# EAGLE design LPC_4TE_3.43_25controller_extv (EAGLE 5.04)
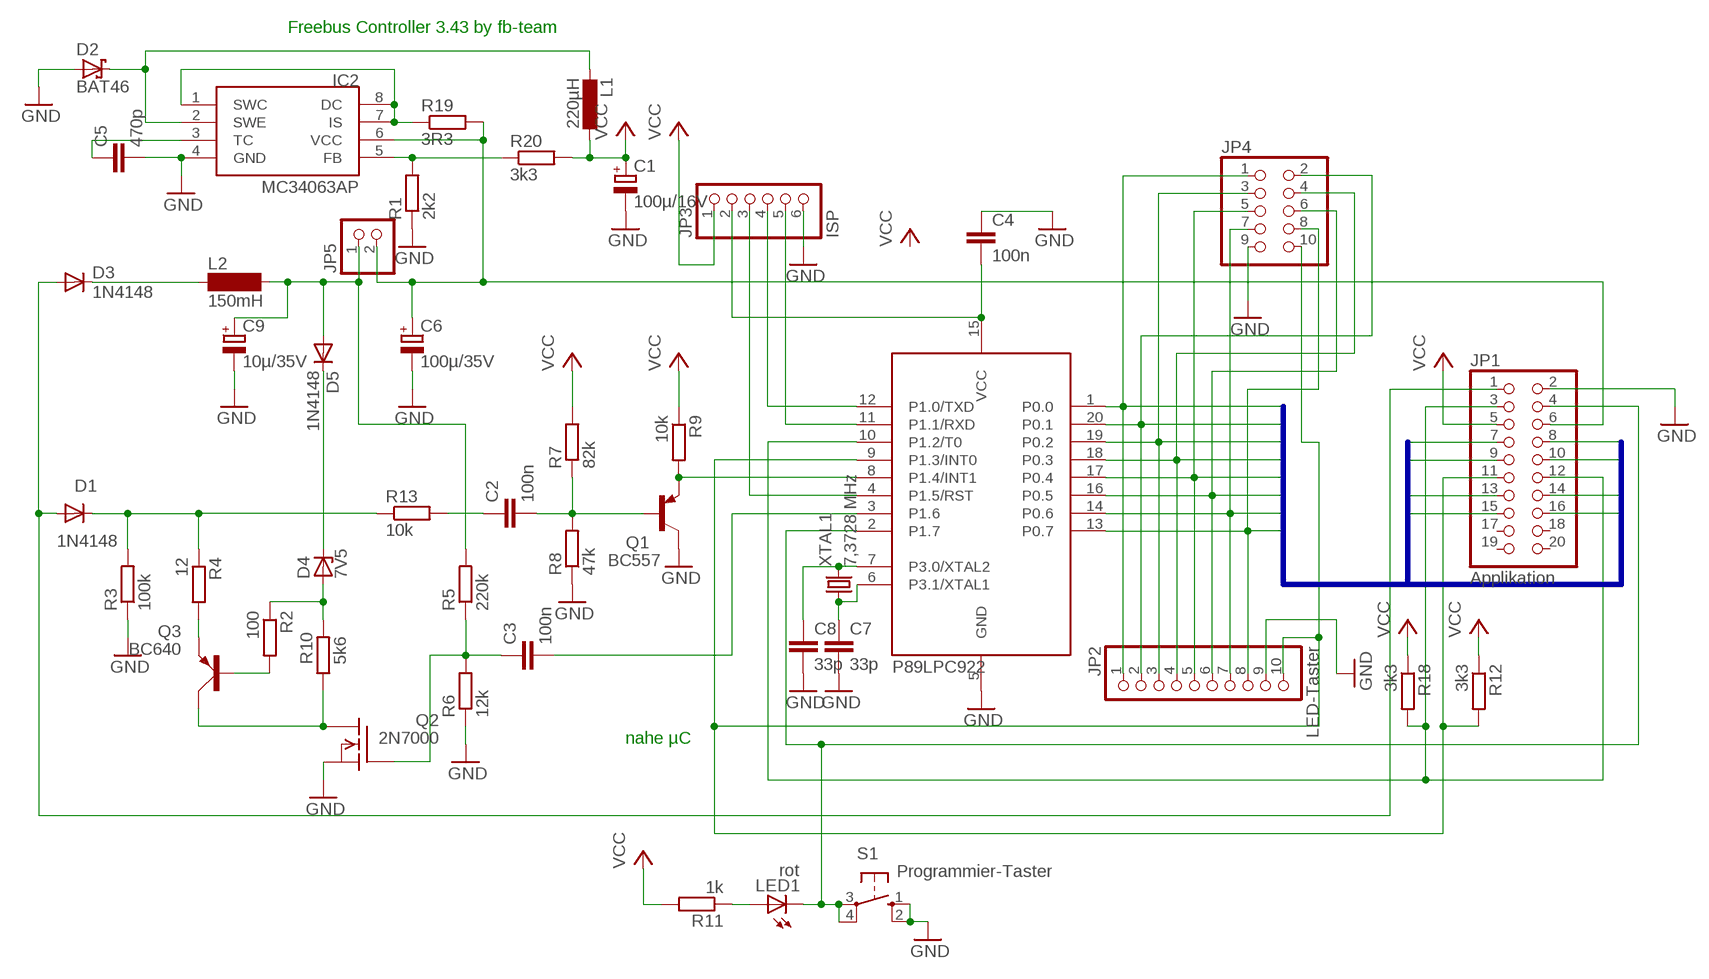
[diagram p0: schematic, sheet 1]

## Parts
C1  100µ/16V  CPOL-EUE5-8.5  [E5-8,5]
C2  100n  C-EU050-024X044  [C050-024X044]
C3  100n  C-EU050-024X044  [C050-024X044]
C4  100n  C-EU050-024X044  [C050-024X044]
C5  470p  C-EU025-024X044  [C025-024X044]
C6  100µ/35V  CPOL-EUE5-8.5  [E5-8,5]
C7  33p  C-EU025-024X044  [C025-024X044]
C8  33p  C-EU025-024X044  [C025-024X044]
C9  10µ/35V  CPOL-EUE5-8.5  [E5-8,5]
D1  1N4148  [DO35-10]
D2  BAT46  BAT49  [DO41-10]
D3  1N4148  [DO35-10]
D4  7V5  ZPD  [DO35Z10]
D5  1N4148  [DO35-10]
IC1  89LPC922  [DIL20]
IC2  MC34063AP  [DIL08]
JP1  Applikation  PINHD-2X10  [2X10]
JP2  LED-Taster  PINHD-1X10  [1X10]
JP3  ISP  PINHD-1X6  [1X06]
JP4  PINHD-2X5  [2X05]
JP5  PINHD-1X2  [1X02]
L1  220µH  L-EU2200-12.7  [2200-12.7]
L2  150mH  SD12-1000  [SD12_1000]
LED1  rot  LED3MM  [LED3MM]
Q1  BC557  [TO92]
Q2  2N7000  VN2222KM  [TO237]
Q3  BC640  [SOT54D]
R1  2k2  R-EU_0207/10  [0207/10]
R2  100  R-EU_0207/10  [0207/10]
R3  100k  R-EU_0207/10  [0207/10]
R4  12  R-EU_0207/10  [0207/10]
R5  220k  R-EU_0207/10  [0207/10]
R6  12k  R-EU_0207/10  [0207/10]
R7  82k  R-EU_0207/10  [0207/10]
R8  47k  R-EU_0207/10  [0207/10]
R9  10k  R-EU_0207/10  [0207/10]
R10  5k6  R-EU_0207/10  [0207/10]
R11  1k  R-EU_0207/10  [0207/10]
R12  3k3  R-EU_0207/10  [0207/10]
R13  10k  R-EU_0207/10  [0207/10]
R18  3k3  R-EU_0207/10  [0207/10]
R19  3R3  R-EU_0207/10  [0207/10]
R20  3k3  R-EU_0207/10  [0207/10]
S1  Programmier-Taster  10-XX  [B3F-10XX]
XTAL1  7,3728 MHz  CRYSTALHC49S  [HC49/S]

## Nets
GND: C1.- C4.1 C5.2 C6.- C7.2 C8.2 C9.- D2.A IC1.5(GND) IC2.4(GND) JP1.2 JP2.9 JP3.6 JP4.9 Q1.3(C) Q2.3(S) R1.1 R3.1 R6.1 R8.1 S1.1(S) S1.2(S1)
N$1: IC1.8(P1.4/INT1) Q1.1(E) R9.2
N$2: C2.2 Q1.2(B) R7.1 R8.2
N$3: IC2.5(FB) R1.2 R20.1
N$4: IC2.1(SWC) IC2.7(IS) IC2.8(DC) R19.1
N$5: C3.2 IC1.3(P1.6)
N$6: Q2.1(D) Q3.C R10.1
N$7: C6.+ IC2.6(VCC) JP1.6 JP5.2 R19.2
N$8: D3.C L2.1
N$9: D1.C R3.2 R4.1 R13.1
N$10: D2.C IC2.2(SWE) L1.2
N$11: D4.A R2.1 R10.2
N$12: Q3.E R4.2
N$13: C5.1 IC2.3(TC)
N$14: Q3.B R2.2
N$15: IC1.9(P1.3/INT0) JP1.11 JP2.10 JP4.10 R12.2
N$16: D1.A D3.A JP1.1
N$17: IC1.2(P1.7) JP1.4 LED1.K(C) S1.3(P) S1.4(P1)
N$18: C2.1 R13.2
N$20: C8.1 IC1.7(P3.0/XTAL2) XTAL1.2
N$21: C7.1 IC1.6(P3.1/XTAL1) XTAL1.1
N$23: C9.+ D5.A JP5.1 L2.2 R5.2
N$29: IC1.12(P1.0/TXD) JP3.4
N$30: IC1.11(P1.1/RXD) JP3.5
N$31: IC1.4(P1.5/RST) JP3.3
N$32: C4.2 IC1.15(VCC) JP3.2
N$33: IC1.10(P1.2/T0) JP1.3 JP1.12 R18.2
N$34: C3.1 Q2.2(G) R5.1 R6.2
N$40: D4.C D5.C
N$41: LED1.A R11.1
P0.0: IC1.1(P0.0) JP1.7 JP2.1 JP4.1
P0.1: IC1.20(P0.1) JP1.8 JP2.2 JP4.2
P0.2: IC1.19(P0.2) JP1.9 JP2.3 JP4.3
P0.3: IC1.18(P0.3) JP1.10 JP2.4 JP4.4
P0.4: IC1.17(P0.4) JP1.13 JP2.5 JP4.5
P0.5: IC1.16(P0.5) JP1.14 JP2.6 JP4.6
P0.6: IC1.14(P0.6) JP1.15 JP2.7 JP4.7
P0.7: IC1.13(P0.7) JP1.16 JP2.8 JP4.8
VCC: C1.+ JP1.5 JP3.1 L1.1 R7.2 R9.1 R11.2 R12.1 R18.1 R20.2
Unconnected: JP1.17 JP1.18 JP1.19 JP1.20

## Buses
P0.[0..7]

## Notes on the sheet
- Freebus Controller 3.43 by fb-team
- P89LPC922
- nahe µC

## Library data of the parts
C1 C6 C9 = rcl:CPOL-EU: POLARIZED CAPACITOR, European symbol
C2-C5 C7 C8 = rcl:C-EU: CAPACITOR, European symbol
D1 D3 D5 = diode:1N4148: DIODE high speed (Philips)
D2 = diode:BAT49: DIODE small signal diode
D4 = diode:ZPD: Z DIODE 500 mW
IC1 = micro-philips:89LPC922
IC2 = mc34063:MC34063
JP1 = pinhead:PINHD-2X10: PIN HEADER
JP2 = pinhead:PINHD-1X10: PIN HEADER
JP3 = pinhead:PINHD-1X6: PIN HEADER
JP4 = pinhead:PINHD-2X5: PIN HEADER
JP5 = pinhead:PINHD-1X2: PIN HEADER
L1 = rcl:L-EU: INDUCTOR, European symbol
L2 = inductor-neosid:SD12: INDUCTOR nominal inductance
LED1 = led:LED: LED OSRAM: - CHIPLED LG R971, LG N971, LY N971, LG Q971, LY Q971, LO R971, LY R971 LH N974, LH R974 LS Q976, LO Q976, LY Q976 LO Q996 - Hyper CHIPLED LW Q18S LB Q993, LB Q99A, LB R99A - SideLED LS A670, LO A670, LY A670, LG A670, LP A670 LB A673, LV A673, LT A673, LW A673 LH A674 LY A675 LS A676, LA A676, LO A676, LY A676, LW A676 LS A679, LY A679, LG A679 - Hyper Micro SIDELED® LS Y876, LA Y876, LO Y876, LY Y876 LT Y87S - SmartLED LW L88C, LW L88S LB L89C, LB L89S, LG L890 LS L89K, LO L89K, LY L89K LS L896, LA L896, LO L896, LY L896 - TOPLED LS T670, LO T670, LY T670, LG T670, LP T670 LSG T670, LSP T670, LSY T670, LOP T670, LYG T670 LG T671, LOG T671, LSG T671 LB T673, LV T673, LT T673, LW T673 LH T674 LS T676, LA T676, LO T676, LY T676, LB T676, LH T676, LSB T676, LW T676 LB T67C, LV T67C, LT T67C, LS T67K, LO T67K, LY T67K, LW E67C LS E67B, LA E67B, LO E67B, LY E67B, LB E67C, LV E67C, LT E67C LW T67C LS T679, LY T679, LG T679 LS T770, LO T770, LY T770, LG T770, LP T770 LB T773, LV T773, LT T773, LW T773 LH T774 LS E675, LA E675, LY E675, LS T675 LS T776, LA T776, LO T776, LY T776, LB T776 LHGB T686 LT T68C, LB T68C - Hyper Mini TOPLED® LB M676 - Mini TOPLED Santana® LG M470 LS M47K, LO M47K, LY M47K Source: http://www.osram.convergy.de - LUMILED® LXK2-PW12-R00, LXK2-PW12-S00, LXK2-PW14-U00, LXK2-PW14-V00 LXK2-PM12-R00, LXK2-PM12-S00, LXK2-PM14-U00 LXK2-PE12-Q00, LXK2-PE12-R00, LXK2-PE12-S00, LXK2-PE14-T00, LXK2-PE14-U00 LXK2-PB12-K00, LXK2-PB12-L00, LXK2-PB12-M00, LXK2-PB14-N00, LXK2-PB14-P00, LXK2-PB14-Q00 LXK2-PR12-L00, LXK2-PR12-M00, LXK2-PR14-Q00, LXK2-PR14-R00 LXK2-PD12-Q00, LXK2-PD12-R00, LXK2-PD12-S00 LXK2-PH12-R00, LXK2-PH12-S00 LXK2-PL12-P00, LXK2-PL12-Q00, LXK2-PL12-R00 Source: www.luxeon.com
Q1 = transistor-pnp:BC557: PNP Transistor
Q2 = transistor-fet:VN2222KM: N-Channel Enhancement MOSFET (VMOS); 60V; 0,5A; 7,5Ohm
Q3 = transistor-small-signal:BC640: PNP TRANSISTOR
R1-R13 R18-R20 = rcl:R-EU_: RESISTOR, European symbol
S1 = switch-omron:10-XX: OMRON SWITCH
XTAL1 = crystal:CRYSTAL: CRYSTAL

## Board
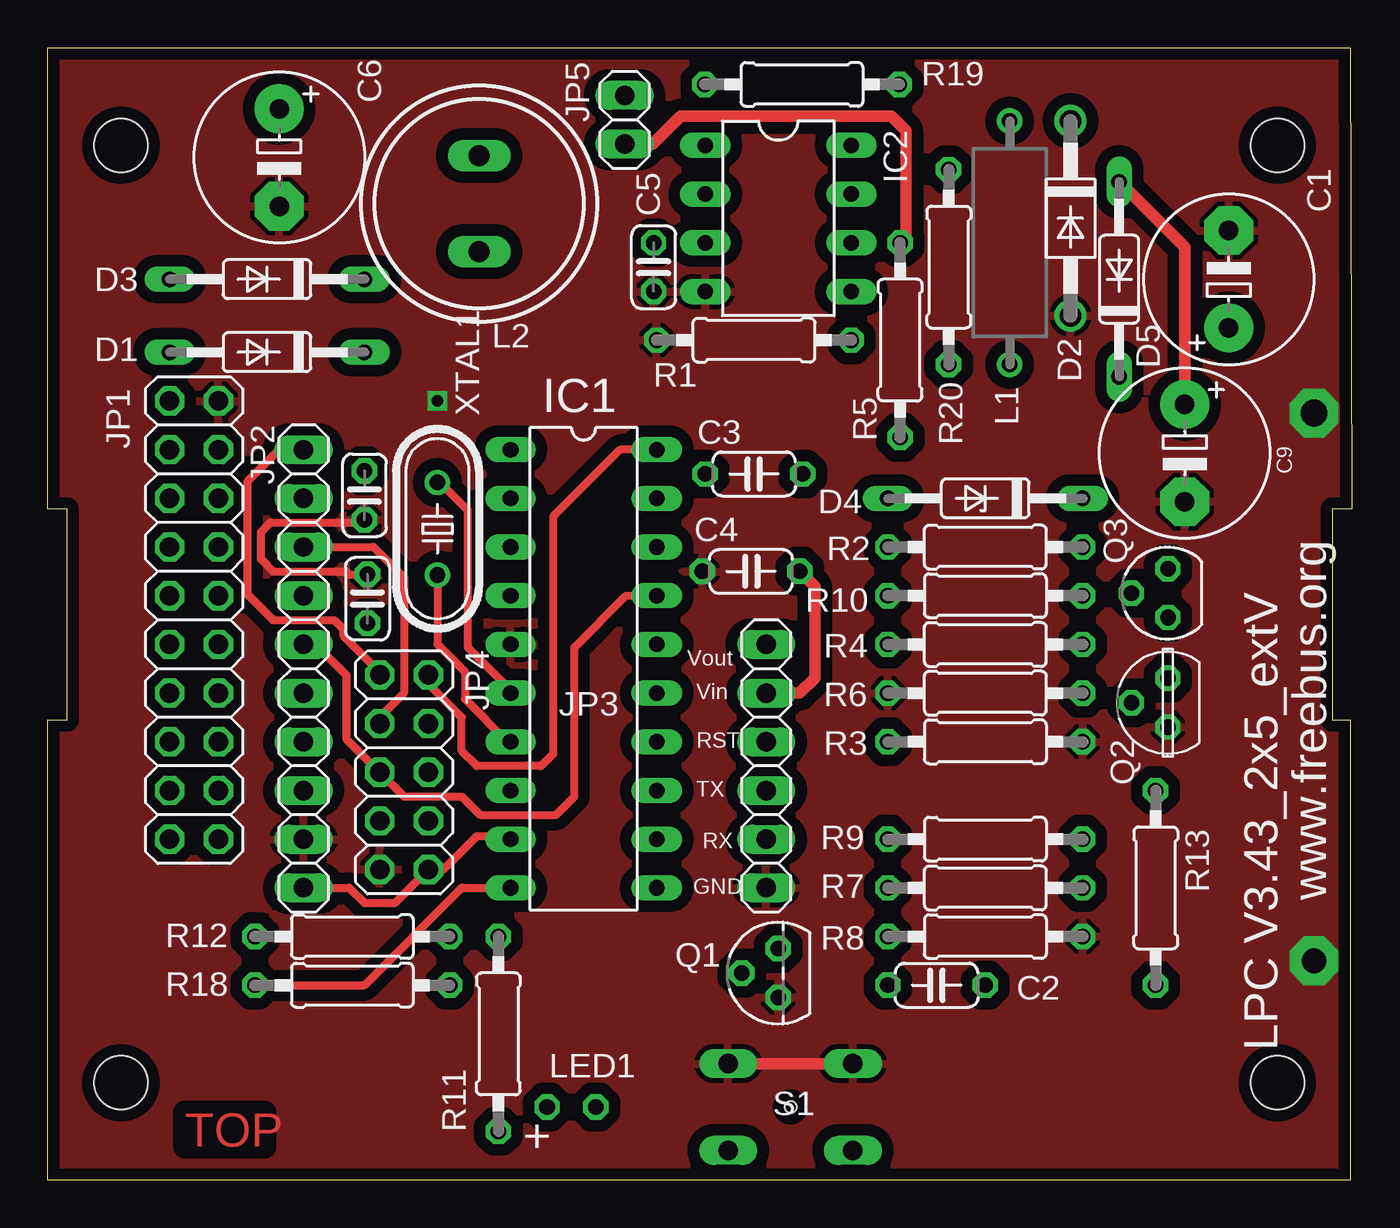
[diagram p1: board, top side]
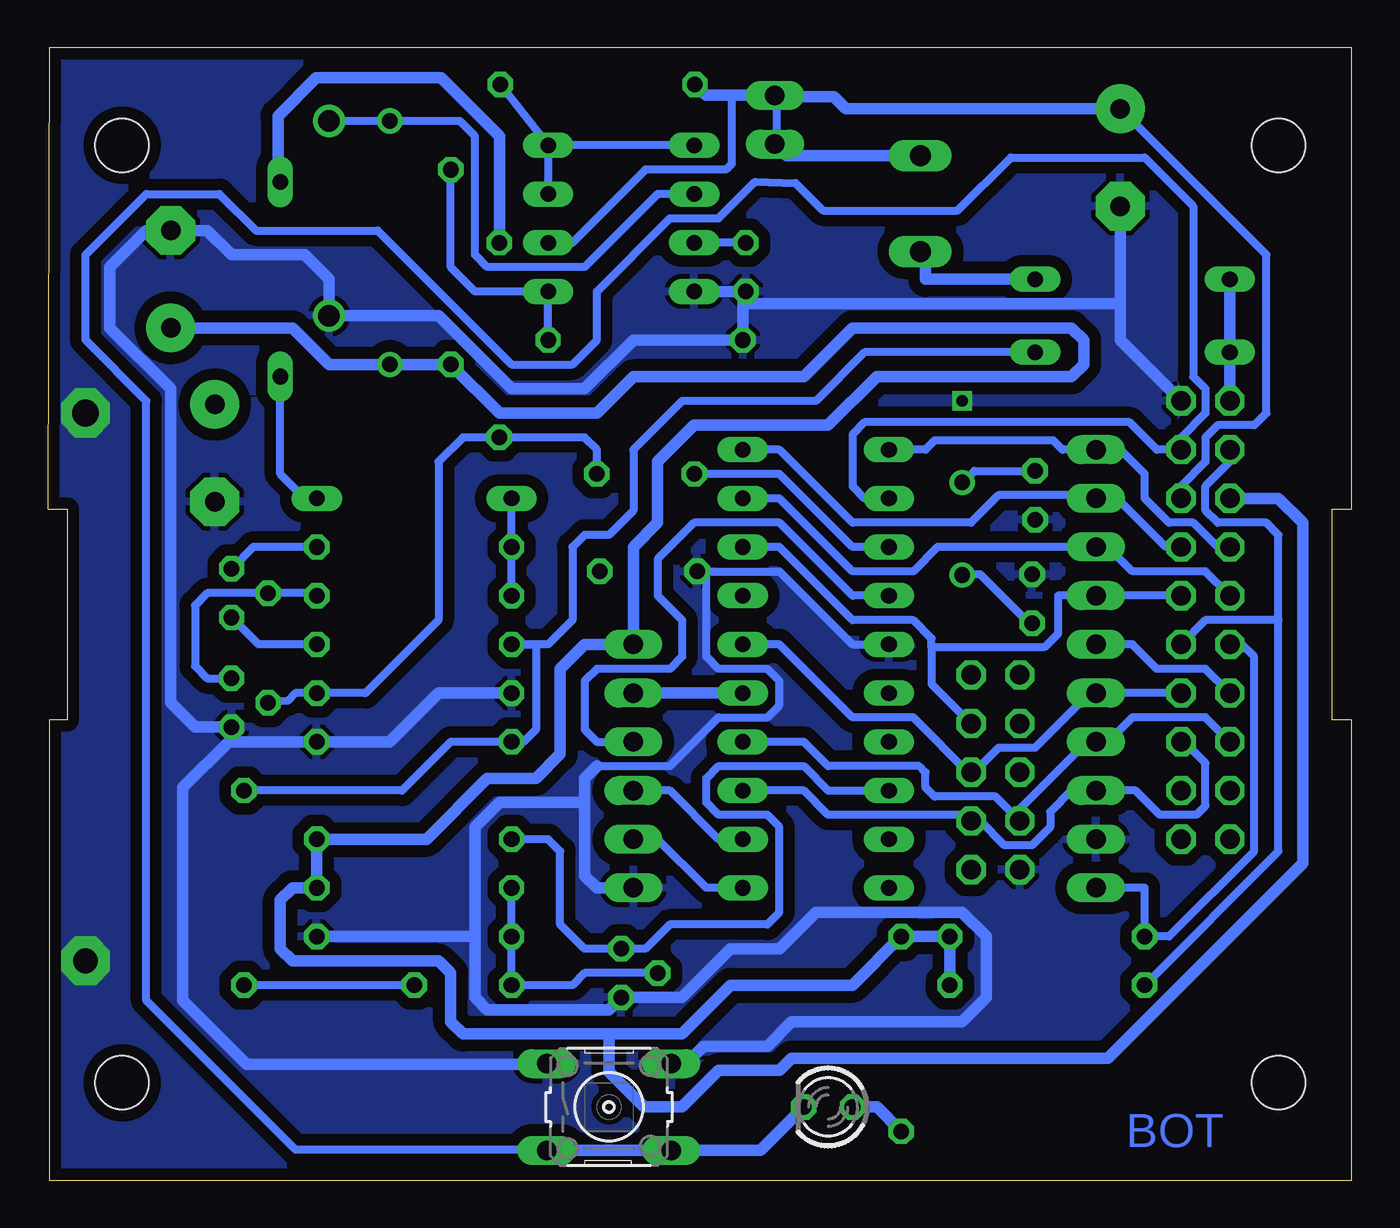
[diagram p2: board, bottom side, seen from below]

Size 68 x 59.05 mm. Coordinates in mm from the lower left corner, seen from the top.
Outline: 0,0 0,24 1,24 1,35 0,35 0,59.05 67.94,59.05 68,35.5 68,35 67,35 67,24 67.94,24 67.94,0 0,0
Copper layers (1*16): Top 0.035mm / dielectric 1.5mm / Bottom 0.035mm
Design rules "default *": minimum track width 10mil, minimum drill 24mil, track to track 12mil, track to pad 12mil, pad to pad 12mil, via to via 12mil, smd to smd 8mil, copper to edge 20mil, drill to drill 8mil, minimum pad ring 10mil, minimum via ring 8mil, stop-mask expansion 4mil, vias tented up to drill 0mil, thermal gap 10mil
Holes 2.8 mm at 3.81,53.98 64.14,53.98 64.14,5.08 3.81,5.08
Holes 0.6 mm at 38.73,3.81

### Footprints (pad centres in the part's own frame; a part is rotated, then mirrored left to right if it is on the bottom)
E5-8,5 = drill 1.016 pad 2.54 round: + -2.54,0 | drill 1.016 pad 2.54 octagon: - 2.54,0
C050-024X044 = drill 0.813 octagon: 1 -2.54,0; 2 2.54,0
C025-024X044 = drill 0.813 octagon: 1 -1.27,0; 2 1.27,0
DO35-10 = drill 0.813 long: A 5.08,0; C -5.08,0
DO41-10 = drill 1.118 round: A 5.08,0; C -5.08,0
DO35Z10 = drill 0.813 long: A 5.08,0; C -5.08,0
DIL20 = drill 0.813 long: 1 -11.43,-3.81; 2 -8.89,-3.81; 3 -6.35,-3.81; 4 -3.81,-3.81; 5 -1.27,-3.81; 6 1.27,-3.81; 7 3.81,-3.81; 8 6.35,-3.81; 9 8.89,-3.81; 10 11.43,-3.81; 11 11.43,3.81; 12 8.89,3.81; 13 6.35,3.81; 14 3.81,3.81; 15 1.27,3.81; 16 -1.27,3.81; 17 -3.81,3.81; 18 -6.35,3.81; 19 -8.89,3.81; 20 -11.43,3.81
DIL08 = drill 0.813 long: 1 -3.81,-3.81; 2 -1.27,-3.81; 3 1.27,-3.81; 4 3.81,-3.81; 5 3.81,3.81; 6 1.27,3.81; 7 -1.27,3.81; 8 -3.81,3.81
2X10 = drill 1.016 octagon: 1 -11.43,-1.27; 2 -11.43,1.27; 3 -8.89,-1.27; 4 -8.89,1.27; 5 -6.35,-1.27; 6 -6.35,1.27; 7 -3.81,-1.27; 8 -3.81,1.27; 9 -1.27,-1.27; 10 -1.27,1.27; 11 1.27,-1.27; 12 1.27,1.27; 13 3.81,-1.27; 14 3.81,1.27; 15 6.35,-1.27; 16 6.35,1.27; 17 8.89,-1.27; 18 8.89,1.27; 19 11.43,-1.27; 20 11.43,1.27
1X10 = drill 1.016 long: 1 -11.43,0; 2 -8.89,0; 3 -6.35,0; 4 -3.81,0; 5 -1.27,0; 6 1.27,0; 7 3.81,0; 8 6.35,0; 9 8.89,0; 10 11.43,0
1X06 = drill 1.016 long: 1 -6.35,0; 2 -3.81,0; 3 -1.27,0; 4 1.27,0; 5 3.81,0; 6 6.35,0
2X05 = drill 1.016 octagon: 1 -5.08,-1.27; 2 -5.08,1.27; 3 -2.54,-1.27; 4 -2.54,1.27; 5 0,-1.27; 6 0,1.27; 7 2.54,-1.27; 8 2.54,1.27; 9 5.08,-1.27; 10 5.08,1.27
1X02 = drill 1.016 long: 1 -1.27,0; 2 1.27,0
2200-12.7 = drill 0.8 pad 1.27 round: 1 -6.35,0; 2 6.35,0
SD12_1000 = drill 1.1 long: 1 -2.5,0; 2 2.5,0
LED3MM = drill 0.813 octagon: A -1.27,0; K 1.27,0
TO92 = drill 0.813 octagon: 1 1.27,0; 2 0,1.905; 3 -1.27,0
TO237 = drill 0.813 octagon: 1 1.27,0; 2 0,1.905; 3 -1.27,0
SOT54D = drill 0.813 octagon: B 1.27,0; C 0,1.905; E -1.27,0
0207/10 = drill 0.813 octagon: 1 -5.08,0; 2 5.08,0
B3F-10XX = drill 1.016 long: 1 -3.251,2.261; 2 3.251,2.261; 3 -3.251,-2.261; 4 3.251,-2.261
HC49/S = drill 0.813 round: 1 -2.413,0; 2 2.413,0

### Placement (x,y rotation side)
C1  61.59,46.99 90 top
C2  46.35,10.16 180 top
C3  36.83,36.83 180 top
C4  36.67,31.75 0 top
C5  31.59,47.62 270 top
C6  12.06,53.34 270 top
C7  16.51,35.72 270 top
C8  16.67,30.32 90 top
C9  59.3,37.92 270 top
D1  11.43,43.18 180 top
D2  53.34,50.16 270 top
D3  11.43,46.99 180 top
D4  48.9,35.56 180 top
D5  55.88,46.99 90 top
IC1  27.94,26.67 270 top
IC2  38.1,50.16 270 top
JP1  7.62,29.21 270 top
JP2  13.34,26.67 270 top
JP3  37.47,21.59 270 top
JP4  18.57,21.27 270 top
JP5  30.08,55.31 90 top
L1  50.16,48.9 90 top
L2  22.5,50.94 90 top
LED1  27.3,3.81 180 bottom
Q1  38.1,10.79 90 top
Q2  58.42,24.9 90 top
Q3  58.42,30.61 90 top
R1  36.83,43.81 0 top
R2  48.9,33.02 0 top
R3  48.9,22.86 180 top
R4  48.9,27.94 0 top
R5  44.45,43.81 90 top
R6  48.9,25.4 0 top
R7  48.9,15.24 0 top
R8  48.9,12.7 180 top
R9  48.9,17.78 180 top
R10  48.9,30.48 180 top
R11  23.5,7.62 90 top
R12  15.88,12.7 180 top
R13  57.79,15.24 270 top
R18  15.88,10.16 180 top
R19  39.33,57.15 180 top
R20  46.99,47.62 270 top
S1  38.73,3.81 0 bottom
XTAL1  20.32,33.97 270 top

### Tracks (layer width: path | path; a pad name or v marks a point on that pad's centre or on a via)
GND  (via drill 0.6, 1.3 pad 2.54, 1.4 pad 2.54)
  Top 0.406: C8.2 15.72,31.59 15.56,31.75 11.75,31.75 11.11,32.38 11.11,33.81 11.59,34.29 16.35,34.29 C7.2
  Top 0.61: S1.1 41.95,6.07 41.91,6.03 41.87,6.07 S1.2
  Bottom 0.406: IC1.5 26.04,27.94 29.84,31.75 33.66,31.75 33.66,27.3 33.02,26.67 30.48,26.67 29.84,26.04 29.84,24.77 30.48,24.13 33.02,24.13 35.56,21.59 39.37,21.59
  Bottom 0.61: JP1.2 12.06,43.81 12.06,45.72 | 12.06,45.72 C6.- | 39.37,21.59 40.01,20.95 40.01,19.68 | JP3.6 39.37,15.24 40.01,15.88 40.01,19.68 | 45.72,12.7 45.72,9.53 45.09,8.89 38.73,8.89 Q1.3 34.92,9.53 32.38,12.06 29.84,12.06 27.94,13.97 20.32,13.97 19.05,12.7 19.05,9.53 20.32,8.26 29.21,8.26 30.48,6.99 33.81,6.99 34.61,6.19 35.56,6.19 35.48,6.12 S1.2 | 45.72,12.7 45.72,18.41 44.45,19.68 40.01,19.68 | 45.72,12.7 R8.1 | R6.1 47.62,25.4 50.16,22.86 R3.1 58.42,22.86 | 58.42,22.86 Q2.3 60.33,23.63 61.59,24.9 61.59,41.27 64.77,44.45 64.77,47.62 62.87,49.53 C1.- 59.69,49.53 58.42,48.26 54.61,48.26 53.34,46.99 D2.A 47.62,45.09 43.81,41.27 40.01,41.27 37.47,43.81 R1.1 31.75,45.72 | IC2.4 C5.2 31.75,45.72 | 31.75,45.72 12.06,45.72 | 41.91,6.03 57.63,6.03 60.96,9.37 60.96,20.48 58.58,22.86 58.42,22.86 | 33.66,31.75 C4.1
  other vias: 66.04,11.43 66.04,40.01 20.32,40.64
  pour Bottom (isolate 0.61): 0,0 0,59.05 67.94,59.05 67.94,0
  pour Top (isolate 0.61): 0,59.05 67.94,59.05 67.94,0.16 0,0.16 0,56.36
N$1
  Bottom 0.406: IC1.8 27.3,20.32 28.57,21.59 33.02,21.59 33.66,20.95 33.66,19.68 33.02,19.05 30.48,19.05 29.84,18.41 29.84,13.97 30.48,13.34 35.56,13.34 36.83,12.06 Q1.1 40.01,12.06 41.27,13.34 41.27,17.14 41.91,17.78 R9.2
N$2
  Bottom 0.406: Q1.2 40.01,10.79 40.64,10.16 C2.2 R8.2 R7.1
N$3
  Bottom 0.406: R1.2 IC2.5 45.72,46.35 46.99,47.62 R20.1
N$4
  Bottom 0.406: IC2.1 IC2.8 | IC2.8 IC2.7 | IC2.8 R19.1
N$5
  Bottom 0.406: IC1.3 26.04,33.02 29.84,36.83 C3.2
N$6
  Bottom 0.406: R10.1 54.11,30.61 Q3.C 59.69,30.61 60.33,29.98 60.33,26.8 59.69,26.17 Q2.1
N$7
  Bottom 0.406: JP1.6 8.89,36.2 7.62,37.47 7.62,38.73 6.99,39.37 5.08,39.37 4.45,40.01 4.45,48.26 C6.+ | IC2.6 40.64,48.9 36.83,52.7 32.64,52.7 32.34,53 32.34,56.58 | 30,56.5 30,54
  Bottom 0.61: C6.+ 26.38,55.88 27,56.5 30,56.5 JP5.2 32.34,56.58 33.68,56.58 R19.2
N$8
  Bottom 0.61: D3.C 22.23,46.99 22.23,48.42 L2.1
N$9
  Bottom 0.406: D1.C 25.4,43.18 27.94,40.64 34.92,40.64 37.47,38.1 37.47,34.92 38.73,33.66 40.01,33.66 40.64,33.02 40.64,29.21 41.91,27.94 R4.1 42.55,27.94 42.55,23.5 43.18,22.86 R3.2 46.99,22.86 49.53,20.32 R13.1 | R13.1
N$10
  Bottom 0.406: IC2.2 36.2,51.44 40.01,47.62 45.09,47.62 45.72,48.26 45.72,54.45 46.51,55.24 L1.2 D2.C
N$11
  Bottom 0.406: D4.A R2.1 R10.2
N$12
  Bottom 0.406: R4.2 57.02,27.94 Q3.E
N$13
  Bottom 0.406: C5.1 IC2.3
N$14
  Bottom 0.406: Q3.B 57.28,33.02 R2.2
N$15
  Top 0.406: JP2.10 15.72,15.24 16.51,14.45 18.1,14.45 JP4.10 | JP4.10 | JP4.10 20.64,16.19 22.38,17.94 23.97,17.94 IC1.9
  Bottom 0.406: JP1.11 5.71,27.94 5.08,27.3 5.08,17.14 9.53,12.7 R12.2 10.79,15.24 JP2.10
N$16
  Bottom 0.61: JP1.1 D1.A D3.A
N$17
  Bottom 0.406: IC1.2 25.4,35.56 26.04,36.2 26.04,38.89 25.4,39.53 11.59,39.53 10.16,38.1 JP1.4 8.89,38.73 7.62,40.01 7.62,41.27 8.26,41.91 8.26,50.8 10.79,53.34 17.78,53.34 20.55,50.57 27.57,50.57 29,52 31.11,52.07 33.02,50.16 35.56,50.16 39.37,46.35 39.37,43.81 40.64,42.55 43.81,42.55 50.8,49.53 57.15,49.53 59.05,51.44 62.87,51.44 66.04,48.26 66.04,43.81 62.87,40.64 62.87,9.37 55.09,1.59 41.91,1.59
  Bottom 0.61: 35.56,1.59 35.52,1.55 S1.4 | 41.91,1.59 41.95,1.55 S1.3 41.99,1.5 41.91,1.43 41.91,1.59 | S1.4 41.87,1.55 41.91,1.59 | S1.4 30.84,1.55 LED1.K
N$18
  Bottom 0.406: 57.94,10.16 | 57.94,10.16 R13.2 | C2.1 57.94,10.16
N$20
  Top 0.406: IC1.7 23.97,22.86 21.75,25.08 21.75,26.51 20.32,27.94 XTAL1.2 20.32,31.59
  Bottom 0.406: C8.1 16.83,29.05 19.37,31.59 20.32,31.59 XTAL1.2
N$21
  Top 0.406: IC1.6 24.13,25.56 21.91,27.78 21.91,34.92 20.32,36.51 XTAL1.1
  Bottom 0.406: XTAL1.1 20.32,36.35 19.68,36.99 C7.1
N$23
  Top 0.61: JP5.1 31.54,54.04 33,55.5 44,55.5 44.75,54.75 44.75,49.2 R5.2 | C9.+ 59.3,48.65 D5.A
  Bottom 0.61: L2.2 29.48,53.44 JP5.1 | R5.2 44.45,54.45 47.5,57.5 54,57.5 56,55.5 56,52.19 D5.A
N$29
  Bottom 0.406: IC1.12 33.02,17.78 35.56,20.32 JP3.4
N$30
  Bottom 0.406: IC1.11 33.66,15.24 36.2,17.78 JP3.5
N$31
  Bottom 0.406: IC1.4 26.04,30.48 29.84,34.29 34.29,34.29 36.2,32.38 36.2,30.48 34.92,29.21 34.92,27.3 35.56,26.67 39.37,26.67 40.01,26.04 40.01,23.5 39.37,22.86 JP3.3
N$32
  Top 0.61: C4.2 | C4.2 40.01,30.96 40.01,26.19 39.21,25.4 JP3.2
  Bottom 0.61: IC1.15 JP3.2
N$33
  Top 0.406: R18.2 16.51,10.16 21.59,15.24 23.97,15.24 24.13,15.08 IC1.10
  Bottom 0.406: 3.81,29.21 3.81,17.14 R18.2 | 3.81,29.21 7.62,29.21 JP1.12 | JP1.3 6.35,37.47 7.62,36.2 7.62,34.92 6.99,34.29 4.45,34.29 3.81,33.66 3.81,29.21
N$34
  Bottom 0.406: Q2.2 55.5,25 55.1,25.4 R6.2 51.44,25.4 47.62,29.21 47.62,37.47 46.35,38.73 R5.1 40.01,38.73 39.37,38.1 C3.1
N$40
  Bottom 0.406: D4.C 54.61,35.56 55.88,36.83 D5.C
N$41
  Bottom 0.61: R11.1 24.77,3.81 LED1.A
P0.0
  Top 0.406: JP4.1 17.3,26.51 15.4,28.42 15.4,28.73 14.92,29.21 11.75,29.21 10.4,30.56 10.4,36.43 12.06,38.1 JP2.1 13.49,38.1
  Bottom 0.406: JP1.7 6.99,33.02 8.26,34.29 9.53,34.29 10.79,35.56 10.79,36.83 12.06,38.1 JP2.1 15.08,38.1 15.56,38.58 21.75,38.58 22.23,38.1 IC1.1
P0.1
  Top 0.406: JP4.2 19.84,25.88 21.59,24.13 21.59,22.38 22.38,21.59 25.72,21.59 26.35,22.23 26.35,34.61 29.84,38.1 IC1.20
  Bottom 0.406: IC1.20 29.84,38.1 26.04,34.29 19.84,34.29 18.41,35.72 13.49,35.72 JP2.2 12.22,35.56 9.68,33.02 JP1.8
P0.2
  Top 0.406: JP4.3 17.3,24.13 18.57,25.4 18.57,31.43 16.99,33.02 JP2.3
  Bottom 0.406: JP1.9 7.62,31.75 11.43,31.75 12.7,33.02 JP2.3 21.59,33.02 22.86,31.75 26.04,31.75 29.84,35.56 IC1.19
P0.3
  Bottom 0.406: IC1.18 29.84,33.02 26.04,29.21 22.86,29.21 21.91,28.26 21.91,27.78 | JP1.10 JP2.4 15.32,30.48 15.32,28.5 16.03,27.78 21.91,27.78 | JP4.4 | 21.91,27.78 21.91,25.88 JP4.4 | JP4.4 19.84,23.97
P0.4
  Top 0.406: JP2.5 13.97,27.94 15.56,26.35 15.56,23.02 JP4.5 | JP4.5 | JP4.5 18.57,20 21.59,20 22.54,19.05 26.51,19.05 27.46,20 27.46,27.78 30.16,30.48 IC1.17
  Bottom 0.406: JP1.13 7.62,26.67 10.16,26.67 11.43,27.94 JP2.5
P0.5
  Bottom 0.406: IC1.16 29.84,27.94 26.04,24.13 22.86,24.13 19.84,21.11 | JP1.14 JP2.6 13.65,25.4 16.51,22.54 18.41,22.54 19.84,21.11 | 19.84,21.11 | 19.84,21.11 JP4.6
P0.6
  Bottom 0.406: JP1.15 7.62,24.13 11.43,24.13 12.7,22.86 JP2.7 13.81,22.86 17.3,19.37 JP4.7 | IC1.14 28.57,22.86 27.3,21.59 22.54,21.59 22.23,21.27 22.23,20.48 21.75,20 18.57,20 JP4.7 | JP4.7
P0.7
  Bottom 0.406: IC1.13 28.57,20.32 27.3,19.05 20,19.05 19.68,18.73 JP4.8 19.37,18.73 18.1,17.46 16.67,17.46 15.72,18.41 15.72,19.21 14.61,20.32 13.49,20.32 13.34,20.48 JP2.8 11.27,20.32 10,19.05 8.1,19.05 7.62,19.53 7.62,21.75 8.73,22.86 JP1.16
VCC
  Bottom 0.61: R18.1 R12.1 R11.2 26.04,10.16 32.38,10.16 34.92,7.62 38.73,7.62 | 38.73,7.62 46.35,7.62 46.99,8.26 46.99,10.79 47.62,11.43 55.24,11.43 55.88,12.06 55.88,14.61 55.24,15.24 R7.2 R9.1 48.26,17.78 45.09,20.95 42.55,20.95 41.27,22.23 41.27,26.67 40.01,27.94 JP3.1 37.47,33.02 36.2,34.29 36.2,37.47 34.29,39.37 27.3,39.37 24.77,41.91 14.61,41.91 13.97,42.55 13.97,43.81 14.61,44.45 26.04,44.45 28.57,41.91 37.47,41.91 39.37,40.01 44.45,40.01 R20.2 L1.1 53.34,42.55 55.24,44.45 C1.+ | JP1.5 3.81,35.56 2.54,34.29 2.54,16.51 12.7,6.35 29.21,6.35 29.84,5.71 33.02,5.71 34.92,3.81 36.91,3.81 38.73,5.64 38.73,7.62

### Text on the board
Top: TOP
Bottom: BOT
tPlace: Vout | Vin | RST | TX | RX | GND | +
tNames: www.freebus.org | LPC V3.43_2x5_extV